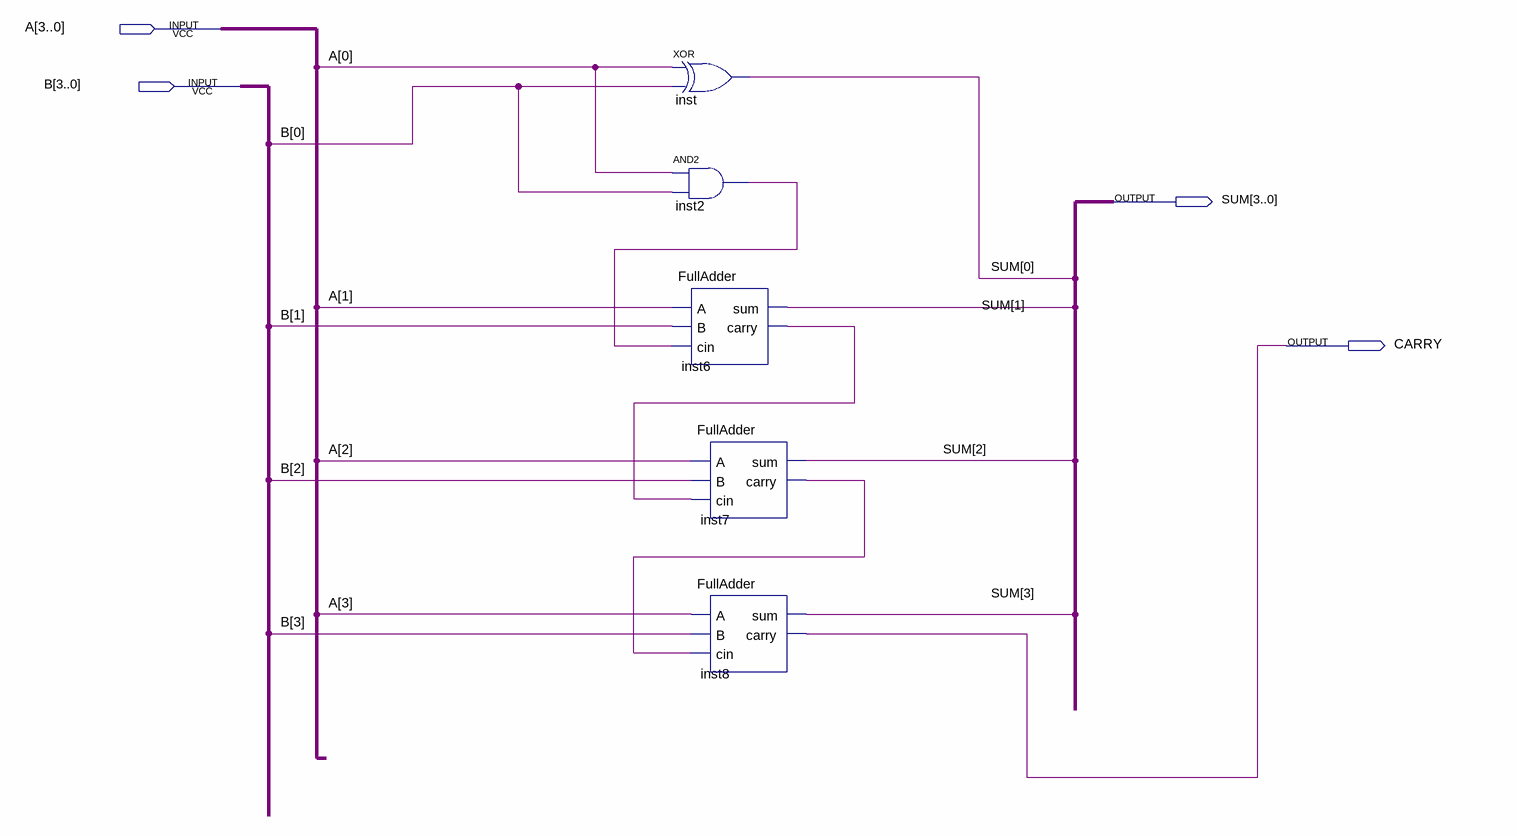
[diagram p0: schematic sheet]
// Quartus schematic Adder4bit.bdf as structural Verilog: 5 symbols, 4 pins
module Adder4bit (
  input  [3:0] A,
  input  [3:0] B,
  output [3:0] SUM,
  output CARRY
);

  wire inst2_out, inst6_carry, inst7_carry;

  xor inst (SUM[0], A[0], B[0]);
  and inst2 (inst2_out, A[0], B[0]);
  FullAdder inst6 (.A(A[1]), .B(B[1]), .cin(inst2_out), .sum(SUM[1]), .carry(inst6_carry));
  FullAdder inst7 (.A(A[2]), .B(B[2]), .cin(inst6_carry), .sum(SUM[2]), .carry(inst7_carry));
  FullAdder inst8 (.A(A[3]), .B(B[3]), .cin(inst7_carry), .sum(SUM[3]), .carry(CARRY));
endmodule
